# Altium schematic sheet Sheet1.SchDoc: GottaGoFastRAM
size A4; ApprovedBy: Matt Harlum; Author: Matt Harlum; CompanyName: LIV2; DrawnBy: Matt Harlum; Engineer: Matt Harlum; Organization: LIV2; DocumentNumber: 1; Revision: B1; SheetNumber: 1; SheetTotal: 1; PageSetup: Record=PageOptions|CenterHorizontal=True|CenterVertical=True|PrintScale=1.00|XCorrection=1.00|YCorrection=1.00|PrintKind=0|BorderSize=5000000|LeftOffset=0|BottomOffset=0|Orientation=2|PaperLength=1000|PaperWidth=1000|Scale=100|PaperSource=7|PrintQuality=-3|MediaType=1|DitherType=10|PrintScaleMode=1|PaperKind=A4|PaperIndex=9; ProjectName: GottaGoFastRAM
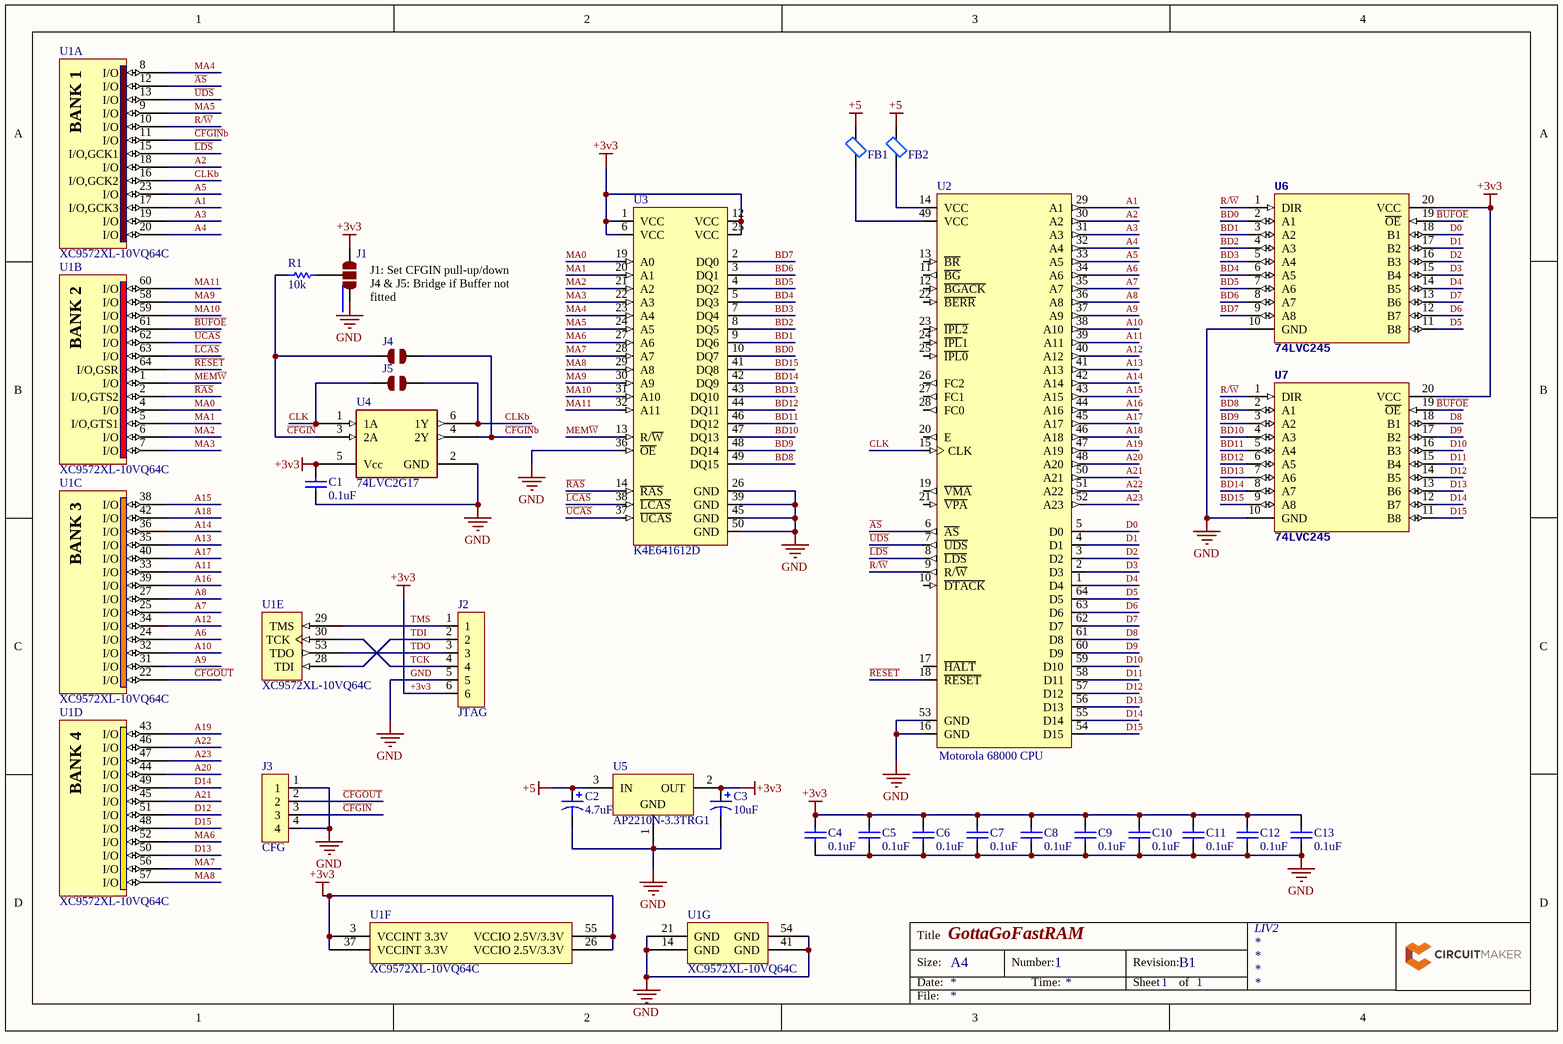
[diagram p0: Sheet1.SchDoc]

## Parts
(Parts that share a designator on the sheet are numbered #1, #2 ... from top to bottom, then left to right.)
C1  0.1uF  [PCB-3hkiqd73wt01svgqmfg0-1]
C2  4.7uF  [CAPMP3217X18-T_V]
C3  10uF  [CAPMP3217X18-T_V]
C4  0.1uF  [PCB-3hkiqd73wt01svgqmfg0-1]
C5  0.1uF  [PCB-3hkiqd73wt01svgqmfg0-1]
C6  0.1uF  [PCB-3hkiqd73wt01svgqmfg0-1]
C7  0.1uF  [PCB-3hkiqd73wt01svgqmfg0-1]
C8  0.1uF  [PCB-3hkiqd73wt01svgqmfg0-1]
C9  0.1uF  [PCB-3hkiqd73wt01svgqmfg0-1]
C10  0.1uF  [PCB-3hkiqd73wt01svgqmfg0-1]
C11  0.1uF  [PCB-3hkiqd73wt01svgqmfg0-1]
C12  0.1uF  [PCB-3hkiqd73wt01svgqmfg0-1]
C13  0.1uF  [PCB-3hkiqd73wt01svgqmfg0-1]
FB1  Ferrite Bead 1206  [PCBComponent_1]  (value not drawn)
FB2  Ferrite Bead 1206  [PCBComponent_1]  (value not drawn)
J1  Solder Jumper 2-way  [PCB-rrnqmtokqinrd1vbp5jt-1]  (value not drawn)
J2  JTAG  [PCB-8aq9xqr7tzfwu5p775g9-1]
J3  CFG  [PCB-liik92rlwtsjwcmfg06e-1]
J4  SMD Jumper  [PCB-20wha1m7m1debrypqlyx-1]  (value not drawn)
J5  SMD Jumper  [PCB-20wha1m7m1debrypqlyx-1]  (value not drawn)
R1  10k  [RESC1609X50X30ML10T20]
U1#1  XC9572XL-10VQ64C  [VQ64_M]  (parts A,B,D,E,F,G of 7)
U1#2  XC9572XL-10VQ64C  [VQ64_L]  (part C of 7)
U2  Motorola 68000 CPU  [DIP64]
U3  K4E641612D  [TSOP50]
U4  74LVC2G17  [PCB-u78y2zn0i4zerhnuhkca-1]
U5  AP2210N-3.3TRG1  [NXP-SOT23_M]
U6  74LVC245  [PCB-yktfl5dzxioysl96c55n-1]
U7  74LVC245  [PCB-yktfl5dzxioysl96c55n-1]

## Nets
+3v3: C1.2 C3.1 C4.2 C5.2 C6.2 C7.2 C8.2 C9.2 C10.2 C11.2 C12.2 C13.2 J1.3 J2.6 U1#1.3(VCCINT_3.3V) U1#1.26(VCCIO_2.5V/3.3V) U1#1.37(VCCINT_3.3V) U1#1.55(VCCIO_2.5V/3.3V) U3.1(VCC) U3.6(VCC) U3.12(VCC) U3.25(VCC) U4.5(Vcc) U5.2(OUT) U6.20(VCC) U7.20(VCC)
+5: C2.1 FB1.2 FB2.2 U5.3(IN)
GND: C1.1 C2.2 C3.2 C4.1 C5.1 C6.1 C7.1 C8.1 C9.1 C10.1 C11.1 C12.1 C13.1 J1.1 J2.5 J3.1 J3.4 U1#1.14(GND) U1#1.21(GND) U1#1.41(GND) U1#1.54(GND) U2.16(GND) U2.53(GND) U3.26(GND) U3.36(~{OE}) U3.39(GND) U3.45(GND) U3.50(GND) U4.2(GND) U5.1(GND) U6.10(GND) U7.10(GND)
A1: U1#1.17(I/O,GCK3) U2.29(A1)
A2: U1#1.18(I/O) U2.30(A2)
A3: U1#1.19(I/O) U2.31(A3)
A4: U1#1.20(I/O) U2.32(A4)
A5: U1#1.23(I/O) U2.33(A5)
A6: U1#2.24(I/O) U2.34(A6)
A7: U1#2.25(I/O) U2.35(A7)
A8: U1#2.27(I/O) U2.36(A8)
A9: U1#2.31(I/O) U2.37(A9)
A10: U1#2.32(I/O) U2.38(A10)
A11: U1#2.33(I/O) U2.39(A11)
A12: U1#2.34(I/O) U2.40(A12)
A13: U1#2.35(I/O) U2.41(A13)
A14: U1#2.36(I/O) U2.42(A14)
A15: U1#2.38(I/O) U2.43(A15)
A16: U1#2.39(I/O) U2.44(A16)
A17: U1#2.40(I/O) U2.45(A17)
A18: U1#2.42(I/O) U2.46(A18)
A19: U1#1.43(I/O) U2.47(A19)
A20: U1#1.44(I/O) U2.48(A20)
A21: U1#1.45(I/O) U2.50(A21)
A22: U1#1.46(I/O) U2.51(A22)
A23: U1#1.47(I/O) U2.52(A23)
~{AS}: U1#1.12(I/O) U2.6(~{AS})
~{BUFOE}: U1#1.61(I/O) U6.19(~{OE}) U7.19(~{OE})
BD0: U3.10(DQ7) U6.2(A1)
BD1: U3.9(DQ6) U6.3(A2)
BD2: U3.8(DQ5) U6.4(A3)
BD3: U3.7(DQ4) U6.5(A4)
BD4: U3.5(DQ3) U6.6(A5)
BD5: U3.4(DQ2) U6.7(A6)
BD6: U3.3(DQ1) U6.8(A7)
BD7: U3.2(DQ0) U6.9(A8)
BD8: U3.49(DQ15) U7.2(A1)
BD9: U3.48(DQ14) U7.3(A2)
BD10: U3.47(DQ13) U7.4(A3)
BD11: U3.46(DQ12) U7.5(A4)
BD12: U3.44(DQ11) U7.6(A5)
BD13: U3.43(DQ10) U7.7(A6)
BD14: U3.42(DQ9) U7.8(A7)
BD15: U3.41(DQ8) U7.9(A8)
~{CFGIN}: J3.3 J4.1 R1.1 U4.3(2A)
~{CFGIN}b: J4.2 U1#1.11(I/O) U4.4(2Y)
~{CFGOUT}: J3.2 U1#2.22(I/O)
CLK: J5.1 U2.15(CLK) U4.1(1A)
CLKb: J5.2 U1#1.16(I/O,GCK2) U4.6(1Y)
D0: U2.5(D0) U6.18(B1)
D1: U2.4(D1) U6.17(B2)
D2: U2.3(D2) U6.16(B3)
D3: U2.2(D3) U6.15(B4)
D4: U2.1(D4) U6.14(B5)
D5: U2.64(D5) U6.11(B8)
D6: U2.63(D6) U6.12(B7)
D7: U2.62(D7) U6.13(B6)
D8: U2.61(D8) U7.18(B1)
D9: U2.60(D9) U7.17(B2)
D10: U2.59(D10) U7.16(B3)
D11: U2.58(D11) U7.15(B4)
D12: U1#1.51(I/O) U2.57(D12) U7.14(B5)
D13: U1#1.50(I/O) U2.56(D13) U7.13(B6)
D14: U1#1.49(I/O) U2.55(D14) U7.12(B7)
D15: U1#1.48(I/O) U2.54(D15) U7.11(B8)
~{LCAS}: U1#1.63(I/O) U3.38(~{LCAS})
~{LDS}: U1#1.15(I/O,GCK1) U2.8(~{LDS})
MA0: U1#1.4(I/O) U3.19(A0)
MA1: U1#1.5(I/O,GTS1) U3.20(A1)
MA2: U1#1.6(I/O) U3.21(A2)
MA3: U1#1.7(I/O) U3.22(A3)
MA4: U1#1.8(I/O) U3.23(A4)
MA5: U1#1.9(I/O) U3.24(A5)
MA6: U1#1.52(I/O) U3.27(A6)
MA7: U1#1.56(I/O) U3.28(A7)
MA8: U1#1.57(I/O) U3.29(A8)
MA9: U1#1.58(I/O) U3.30(A9)
MA10: U1#1.59(I/O) U3.31(A10)
MA11: U1#1.60(I/O) U3.32(A11)
MEM~{W}: U1#1.1(I/O) U3.13(R/~{W})
R/~{W}: U1#1.10(I/O) U2.9(R/~{W}) U6.1(DIR) U7.1(DIR)
~{RAS}: U1#1.2(I/O,GTS2) U3.14(~{RAS})
~{RESET}: U1#1.64(I/O,GSR) U2.18(~{RESET})
TCK: J2.4 U1#1.30(TCK)
TDI: J2.2 U1#1.28(TDI)
TDO: J2.3 U1#1.53(TDO)
TMS: J2.1 U1#1.29(TMS)
~{UCAS}: U1#1.62(I/O) U3.37(~{UCAS})
~{UDS}: U1#1.13(I/O) U2.7(~{UDS})
NetFB1_1: FB1.1 U2.49(VCC)
NetFB2_1: FB2.1 U2.14(VCC)
NetJ1_2: J1.2 R1.2

Not connected (* = marked no-connect by the designer): U2 10(~{DTACK}) 11(~{BG}) 12(~{BGACK}) 13(~{BR}) 17(~{HALT}) 19(~{VMA}) 20(E) 21(~{VPA}) 22(~{BERR}) 23(~{IPL2}) 24(~{IPL}1) 25(~{IPL0}) 26(FC2) 27(FC1) 28(FC0)

## Notes on the sheet
- (near J1) J1: Set CFGIN pull-up/down
  J4 & J5: Bridge if Buffer not fitted
- Title
- Size:
- Date:
- A4
- Number:
- Time:
- Revision:
- Sheet
- of
- File:
- (in symbol CMP-1119795-2, part A) BANK 1
- (in symbol CMP-1119795-2, part B) BANK 2
- (in symbol CMP-1119795-2, part C) BANK 3
- (in symbol CMP-1119795-2, part D) BANK 4

## Library data of the parts
C1 C4-C13 = CMP-v9xraxk7miuib2kehxlr-1: Generic 0603 capacitor; CustomComponentID: v9xraxk7miuib2kehxlr
C2 C3 = CMP-2ozuymxld1sa6u2v4u9d-1: Tantalum Capacitor 1206; CustomComponentID: 2ozuymxld1sa6u2v4u9d
FB1 FB2 = CMP-vapzwqbgisrkk1gonvx3-3: CustomComponentID: vapzwqbgisrkk1gonvx3
J1 = CMP-0rfjo47dqw9gp5mzow1m-3: SMD Jumper; CustomComponentID: 0rfjo47dqw9gp5mzow1m
J2 = CMP-lzh003hclxjnhvei52ud-1: CustomComponentID: lzh003hclxjnhvei52ud
J3 = CMP-yp00jkkdy3rh0a4tao7l-2: 2.54mm Header 4-pos; CustomComponentID: yp00jkkdy3rh0a4tao7l
J4 J5 = CMP-tvx73bcnyo619itupziq-4: CustomComponentID: tvx73bcnyo619itupziq
R1 = CMP-4ggeht5ds2zzqppcu1yw-1: 0603 Resistor; CustomComponentID: 4ggeht5ds2zzqppcu1yw
U1#1 U1#2 = CMP-1119795-2: FastFLASH XC900XL, 3.3V High-Performance 72 Macrocell CPLD, 52 User I/Os, 64-Pin VQFP, Speed Grade 10, Commercial Grade; Lead-Free Status: Contains Lead; Number of I/O Pins: 52; Manufacturer Part Number: XC9572XL-10VQ64C; Mounting Style: Surface Mount; Octopart Url: https://octopart.com/xc9572xl-10vq64c-xilinx-432815; OctopartID: 11a7d8abae6ece60; Packaging: Bulk; RoHS: Non-Compliant; Supply Voltage (DC): 3.3 V
U2 = CMP-3nf2h6cy6zhld4zxhkue-1: Motorola 68000 Microprocessor; CustomComponentID: 3nf2h6cy6zhld4zxhkue
U3 = CMP-d055192a41d60f92-1: 4M x 16bit CMOS Dynamic RAM with Fast Page Mode; Manufacturer Part Number: KM416C4100AS-6; Octopart URL: https://octopart.com/km416c4100as-6-samsung-7714021; OctopartID: d055192a41d60f92
U4 = CMP-1348350-4: IC BUFF SCHMT TRG DL N-INV 6TSOP; Number of Pins: 6; RoHS: Compliant
U5 = CMP-15095086-5: IC REG LDO 3.3V 0.3A SOT23; Voltage Input max: 13.2V; Current Output: 300mA; Package: SOT-23-3; Lifecycle Status: Not Listed by Manufacturer; Mounting Type: Surface Mount; Voltage Output: 3.3V
U6 U7 = CMP-879f4e9240515858-1: Logic IC - Receiver, transceiver Texas Instruments SN74LVC245APWR TSSOP 20; Lead-Free Status: Lead Free; Number of Gates: 8; Supply Voltage (DC): 2.00 V to 3.60 V; Propagation Delay Max (tpd): 6.50 ns; Output Current Drive: -1.00 mA; Voltage Nodes: 3.30 V, 2.70 V, 2.50 V, 1.80 V; Octopart URL: http://octopart.com/sn74lvc245apwr-texas+instruments-516776; REACH SVHC Compliance: No SVHC; Number of Outputs: 8; Lifecycle Status: Active; Number of Pins: 20; Number of Circuits: 8; Manufacturer Part Number: SN74LVC245APWR; Case/Package: TSSOP; RoHS: Compliant; Number of Bits: 8